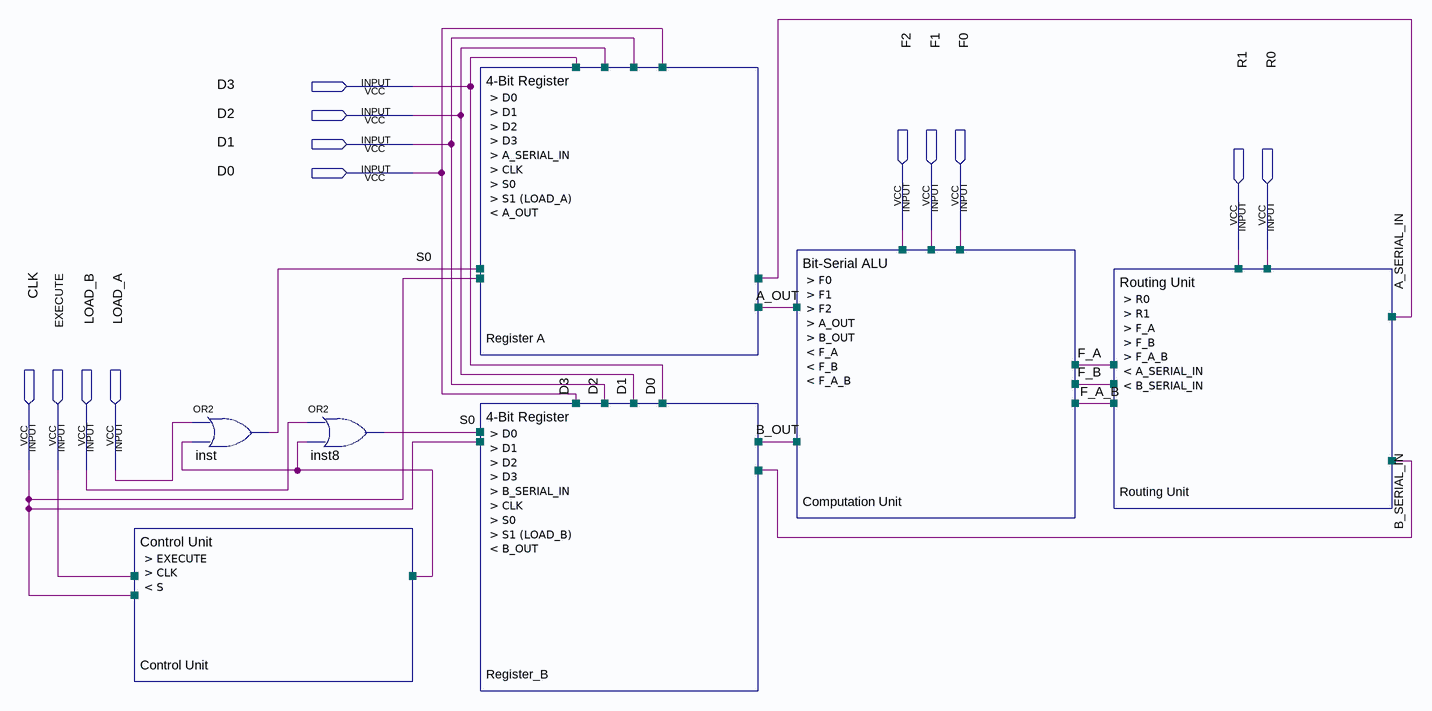
[diagram p0: schematic sheet]
// Quartus schematic Overall Block Diagram.bdf as structural Verilog: 7 symbols, 13 pins
module \Overall_Block_Diagram  (
  input  D3,
  input  D2,
  input  D1,
  input  D0,
  input  F2,
  input  F1,
  input  F0,
  input  R1,
  input  R0,
  input  CLK,
  input  EXECUTE,
  input  LOAD_B,
  input  LOAD_A
);

  wire A_OUT, A_SERIAL_IN, B_OUT, B_SERIAL_IN, F_A, F_A_B, F_B, S0, undriven;

  \Control_Unit  \Control_Unit  (.EXECUTE(EXECUTE), .CLK(CLK));  // open: S
  or inst (S0, LOAD_A, undriven);
  or inst8 (S0, LOAD_B, undriven);
  \4-Bit_Register  \Register_A  (
    .D0(D0), .D1(D1), .D2(D1), .D3(D0), .A_SERIAL_IN(A_SERIAL_IN), .CLK(CLK), .S0(S0), .A_OUT(A_OUT));  // open: S1 (LOAD_A)
  \4-Bit_Register  Register_B (
    .D0(D0), .D1(D1), .D2(D1), .D3(D0), .B_SERIAL_IN(B_SERIAL_IN), .CLK(CLK), .S0(S0), .B_OUT(B_OUT));  // open: S1 (LOAD_B)
  \Bit-Serial_ALU  \Computation_Unit  (
    .F0(F0), .F1(F1), .F2(F2), .A_OUT(A_OUT), .B_OUT(B_OUT), .F_A(F_A), .F_B(F_B), .F_A_B(F_A_B));
  \Routing_Unit  \Routing_Unit  (
    .R0(R0), .R1(R1), .F_A(F_A), .F_B(F_B), .F_A_B(F_A_B), .A_SERIAL_IN(A_SERIAL_IN),
    .B_SERIAL_IN(B_SERIAL_IN));

  assign D2 = D1;
  assign D3 = D0;
endmodule
